# EasyEDA Pro project ALLModule_v1_0_2025-04-21.eprj, schematic MasterCtrlSchematic

## Sheets
1 MasterChip: Board Name: MasterCtrlBoard; Create Date: 2025-04-21; Page Name: MasterChip; Project Name: ALLModule_v1_0_2025-04-21; Schematic Name: MasterCtrlSchematic; Update Date: 2025-04-30; Company: 嘉立创EDA; Drawed: BumpZhi; Page Size: A4; Version: V1.0
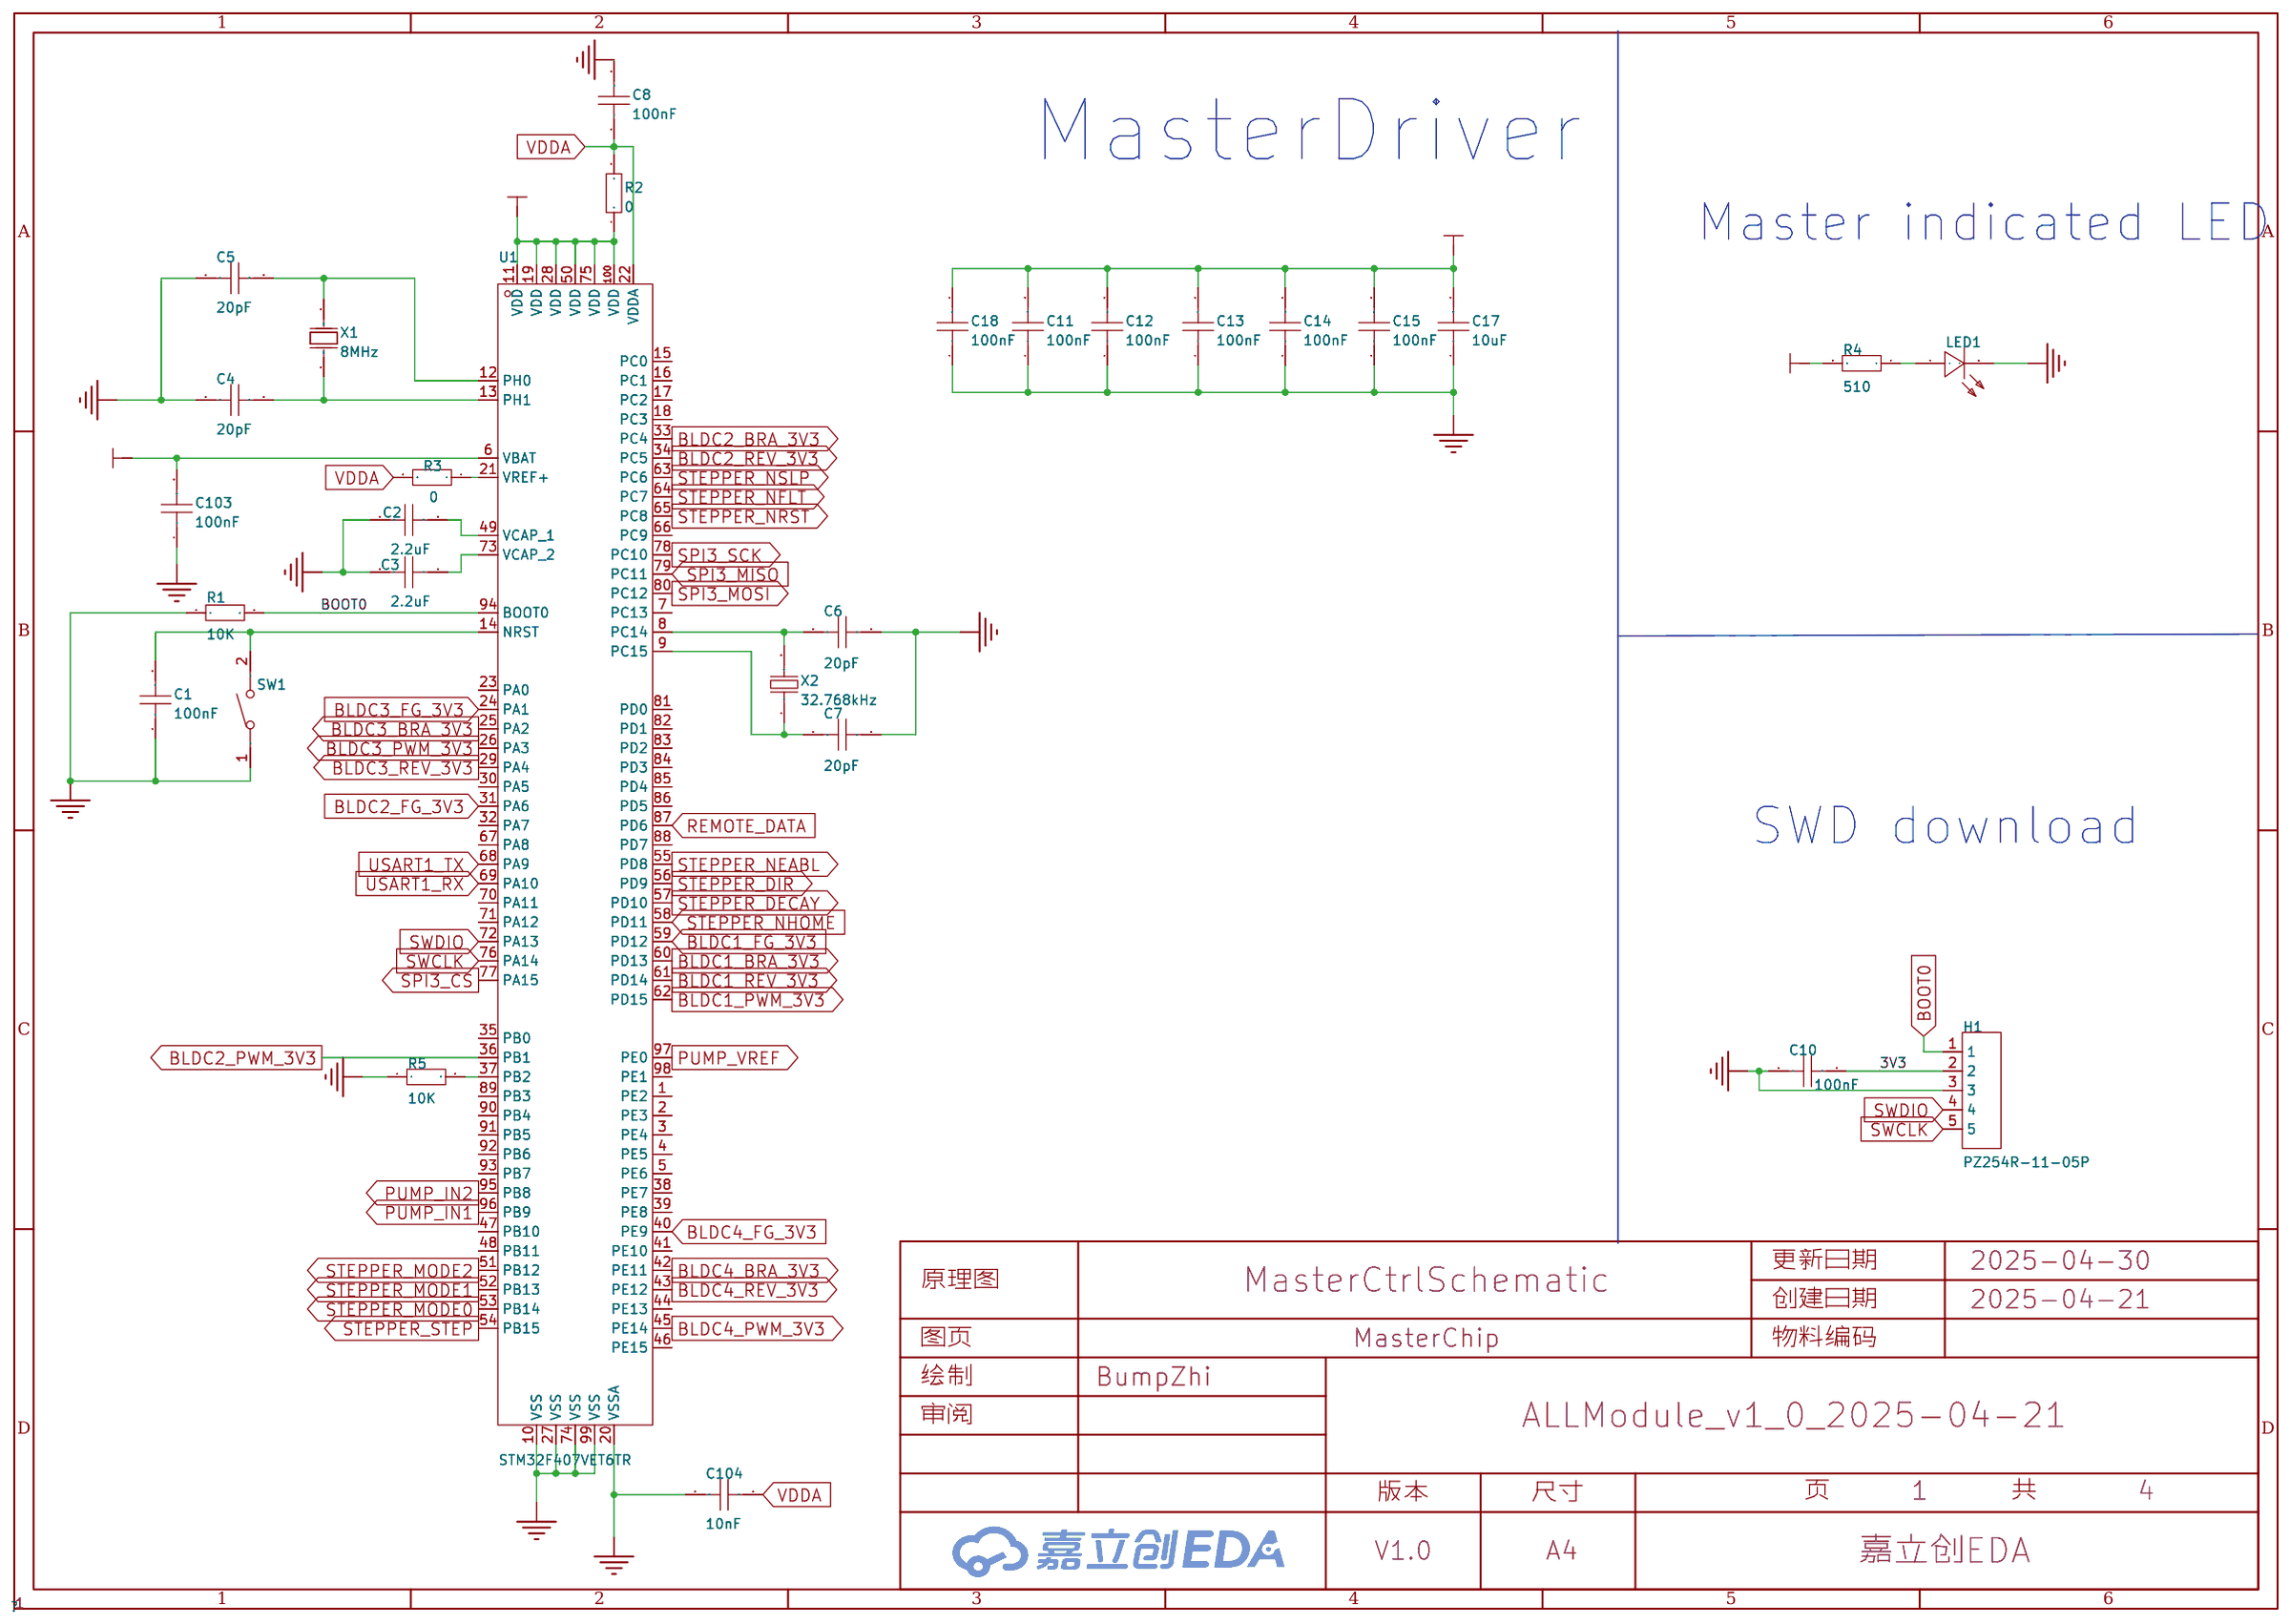
[diagram p0: MasterChip]
2 PowerCtrl: Create Date: 2025-04-22; Page Name: PowerCtrl; Update Date: 2025-05-10
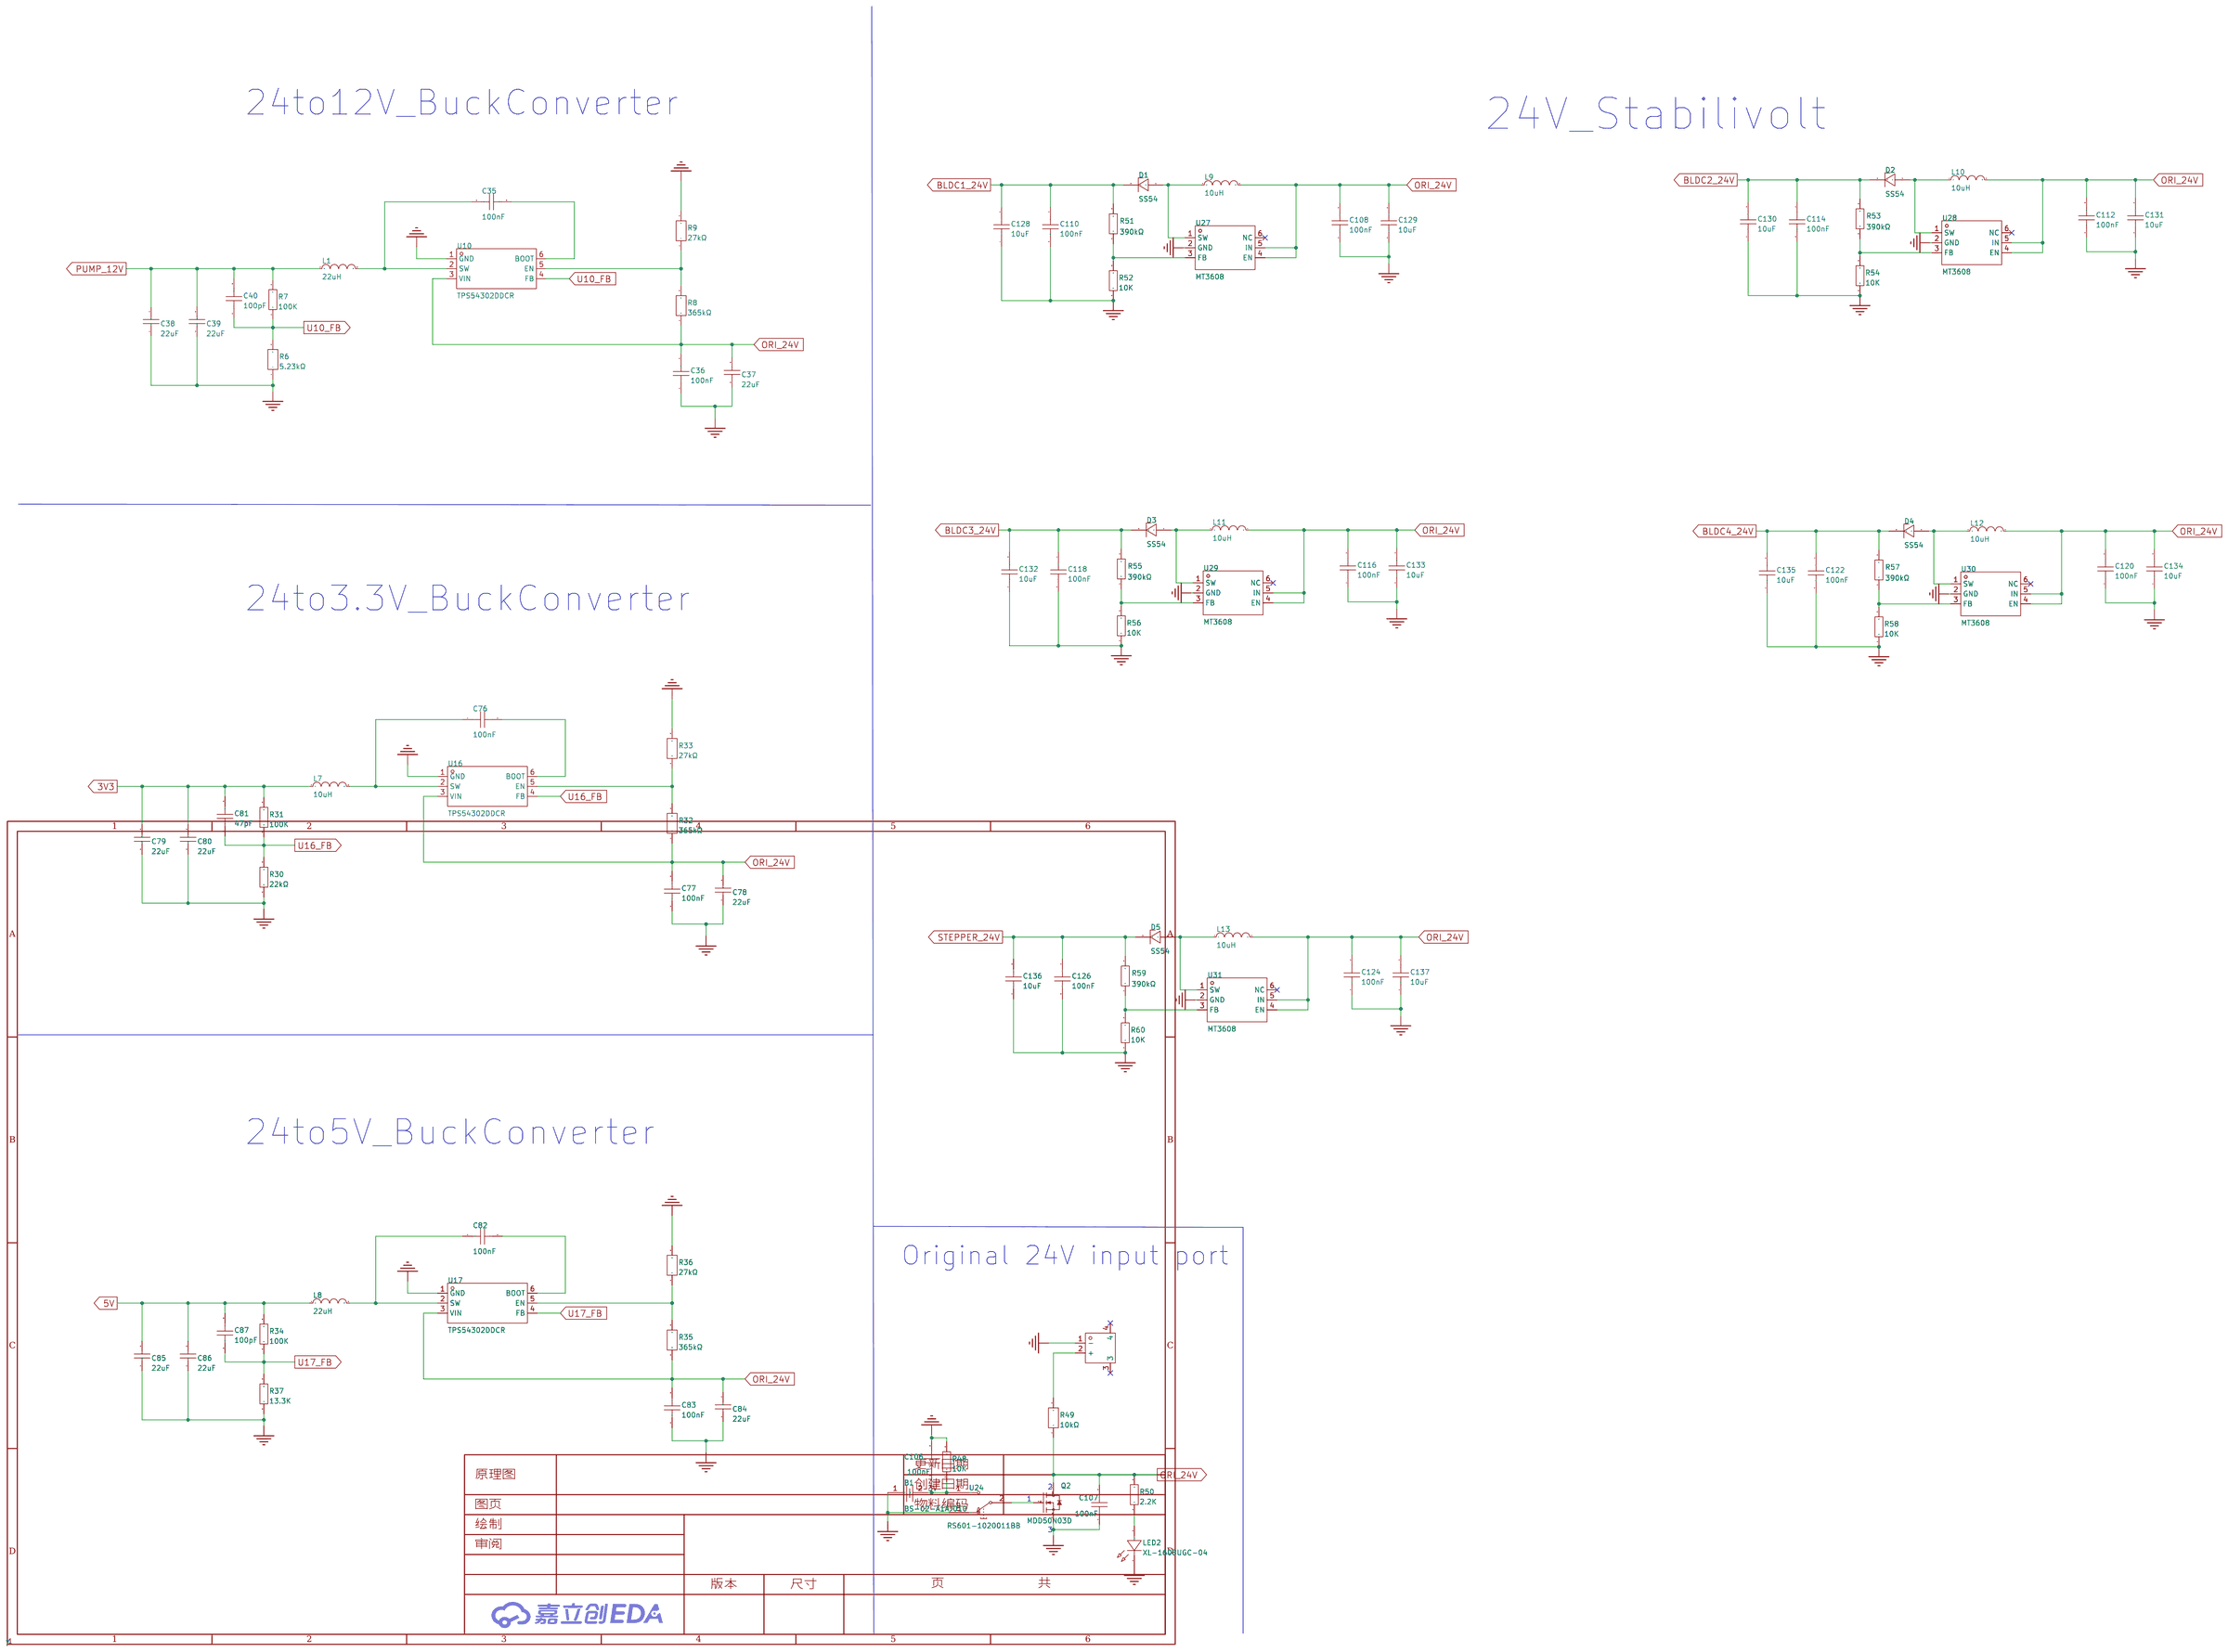
[diagram p1: PowerCtrl]
3 MotorCtrl: Create Date: 2025-04-23; Page Name: MotorCtrl; Update Date: 2025-04-28
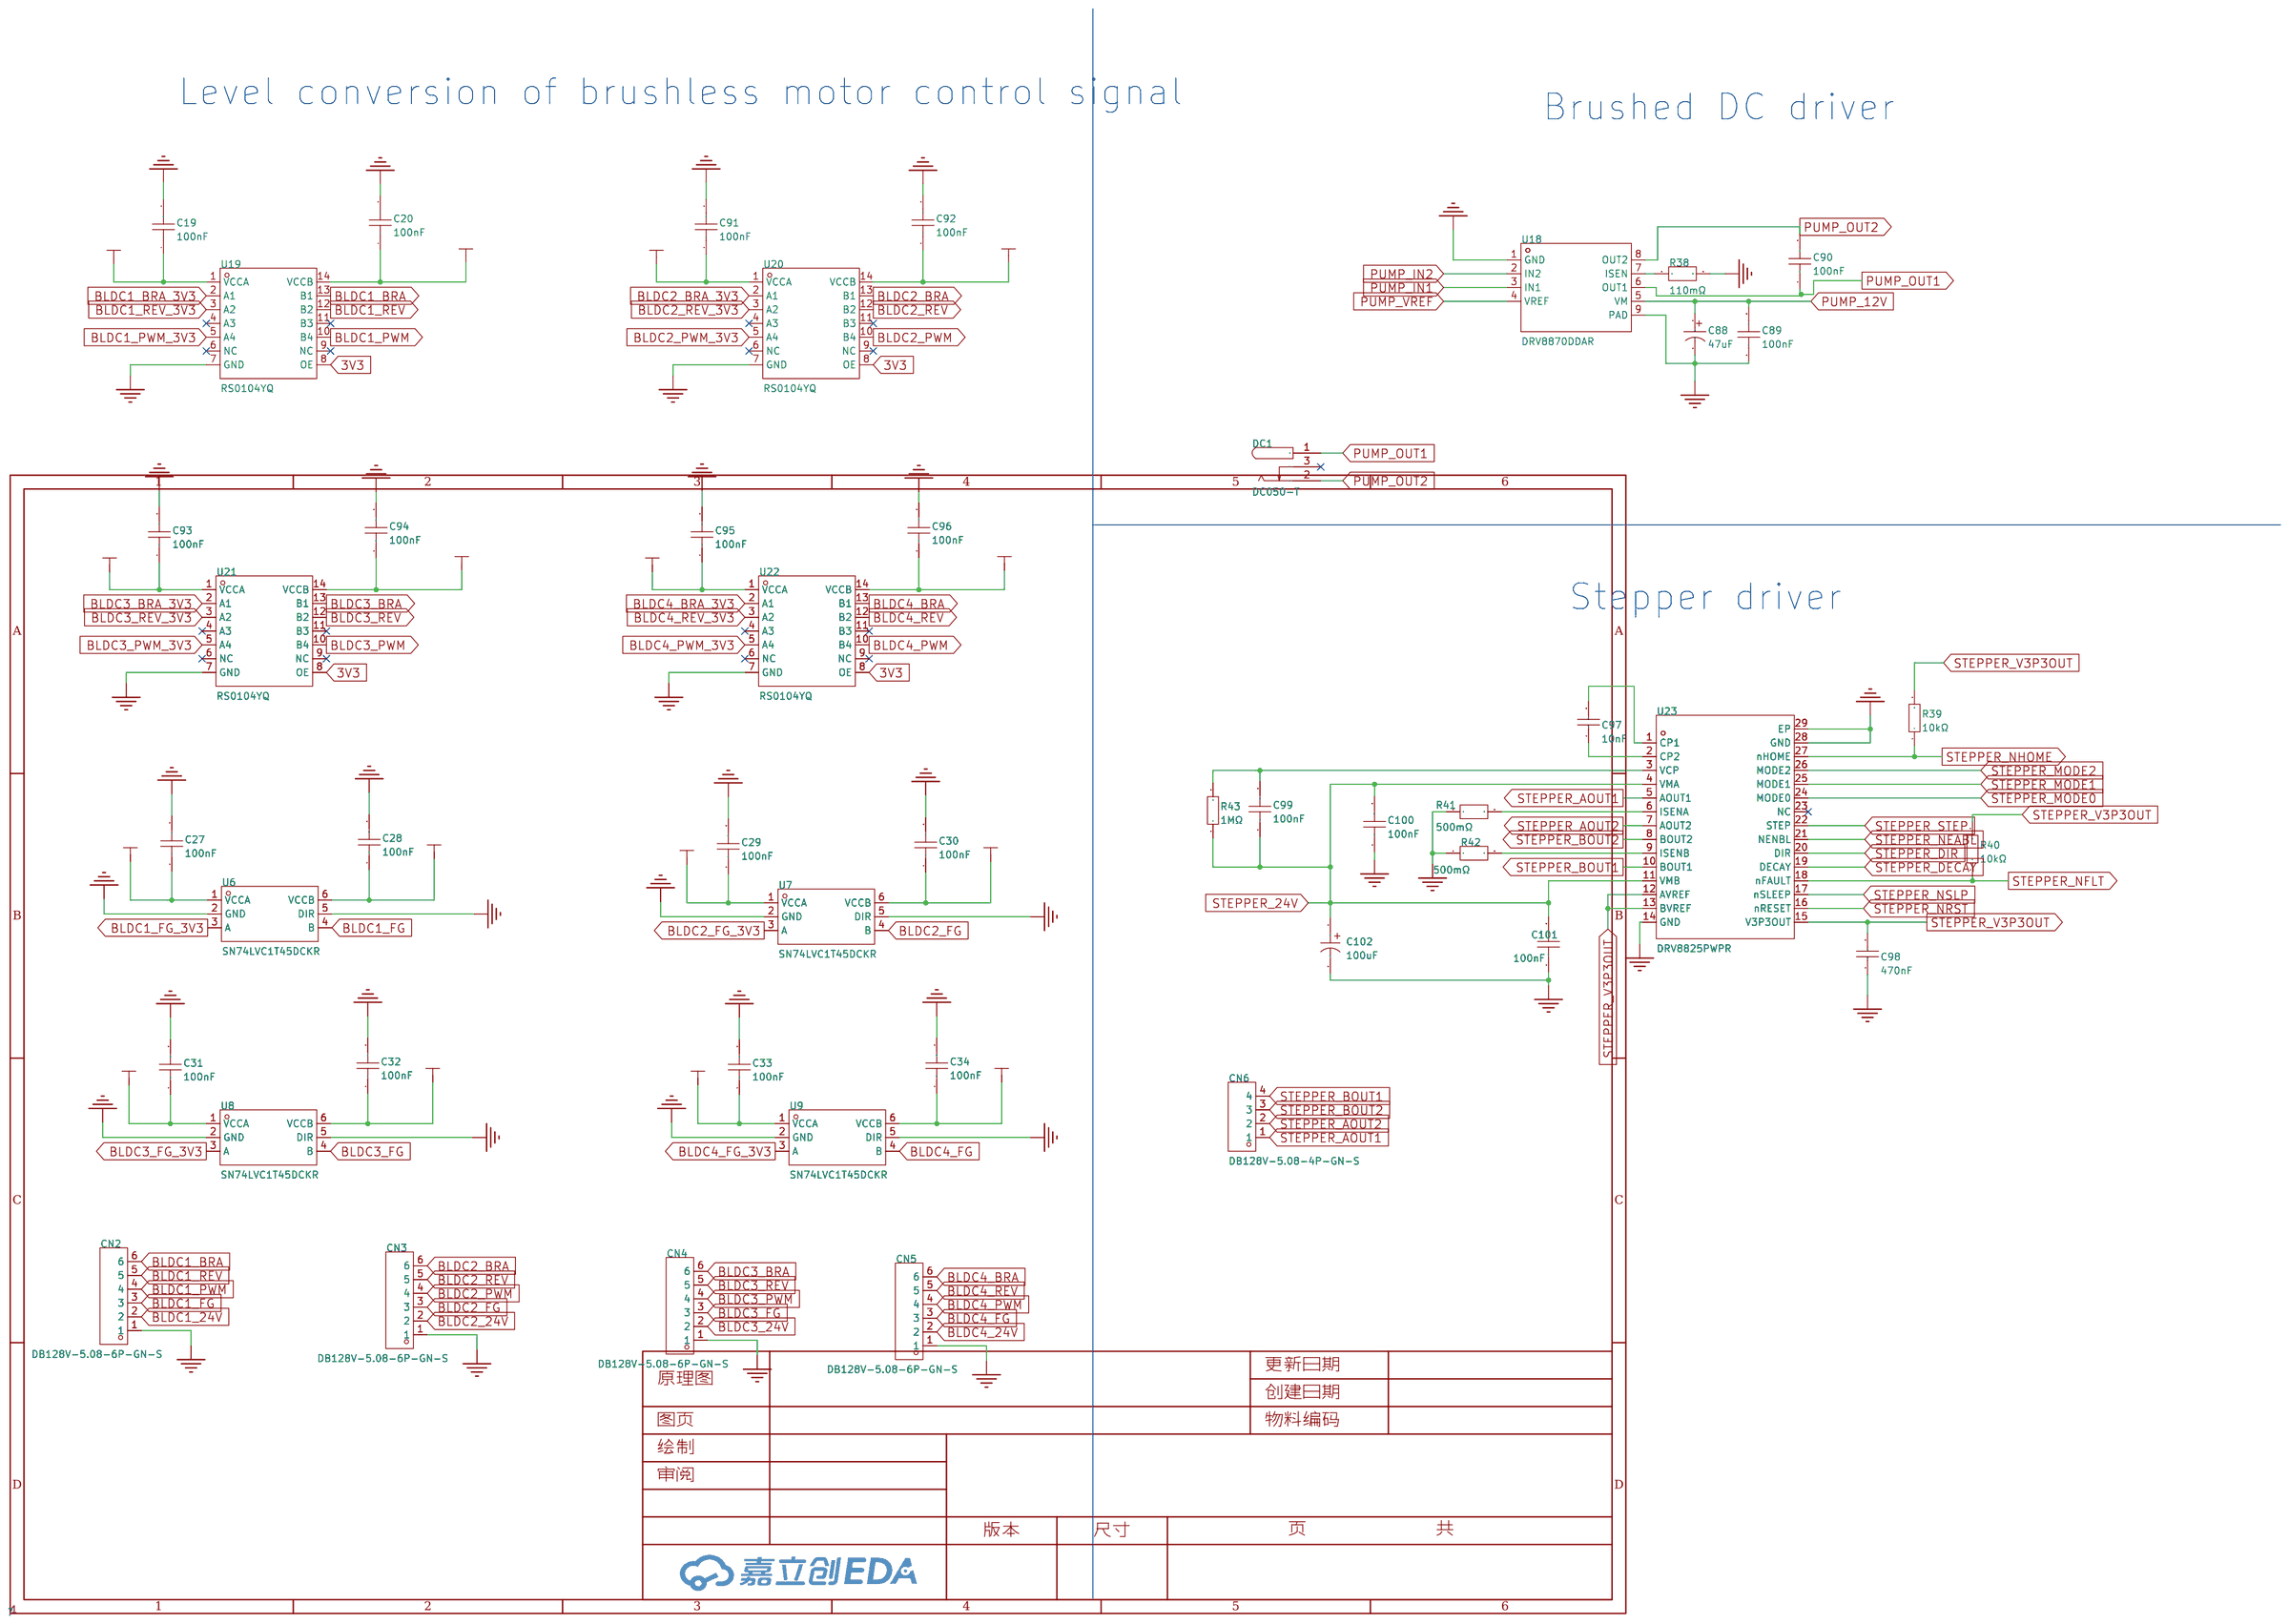
[diagram p2: MotorCtrl]
4 RemoteCtrl: Create Date: 2025-04-23; Page Name: RemoteCtrl
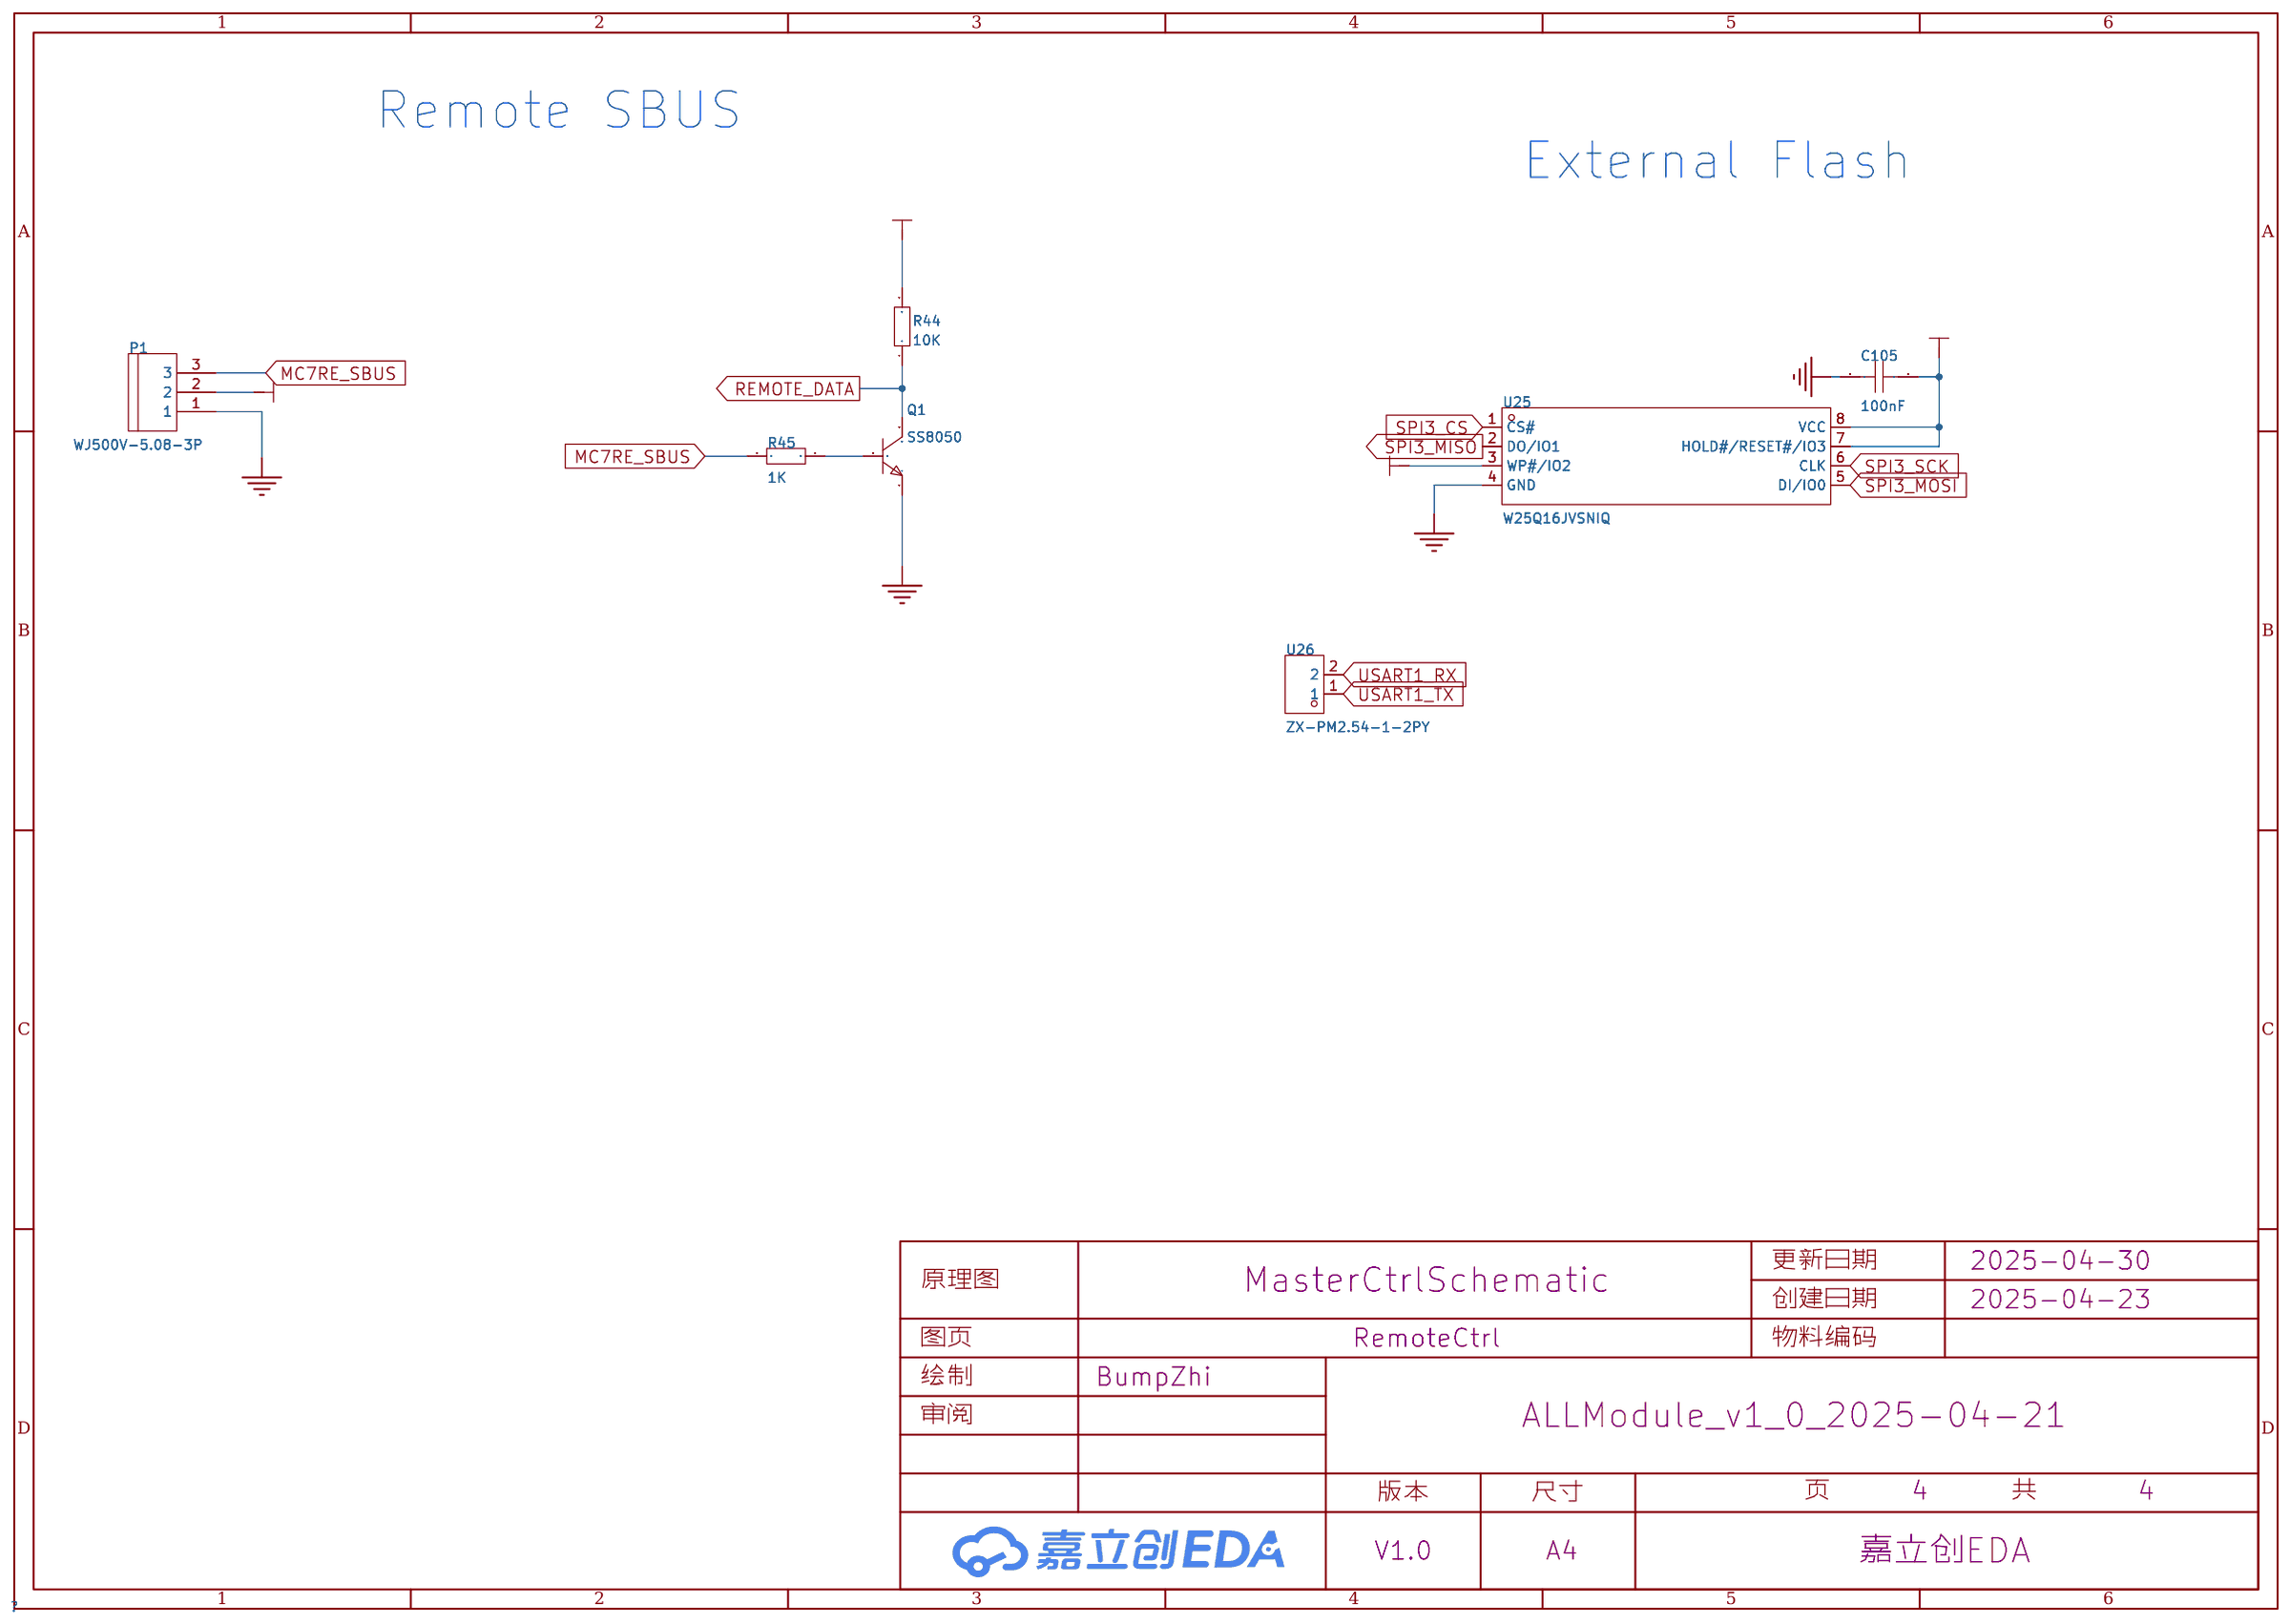
[diagram p3: RemoteCtrl]

## Parts
sheet MasterChip
C1  100nF  [C0603]
C2  2.2uF  [C0603]
C3  2.2uF  [C0603]
C4  20pF  [C0603]
C5  20pF  [C0603]
C6  20pF  [C0603]
C7  20pF  [C0603]
C8  100nF  [C0603]
C10  100nF  [C0603]
C11  100nF  [C0603]
C12  100nF  [C0603]
C13  100nF  [C0603]
C14  100nF  [C0603]
C15  100nF  [C0603]
C17  10uF  [C0603]
C18  100nF  [C0603]
C103  100nF  [C0603]
C104  10nF  [C0603]
H1  PZ254R-11-05P  [HDR-TH_5P-P2.54-H-M-W10.4]
LED1  SZYY0805R  [LED0805-R-RD]
R1  10K  [R0603]
R2  0  [R0603]
R3  0  [R0603]
R4  510  [R0603]
R5  10K  [R0603]
SW1  TS-1088-AR02016  [SW-SMD_L3.9-W3.0-P4.45]
U1  STM32F407VET6TR  [LQFP-100_L14.0-W14.0-P0.50-LS16.0-BL]
X1  8MHz  [CRYSTAL-SMD_L11.5-W4.8-LS12.7]
X2  32.768kHz  [FC-135R_L3.2-W1.5]
sheet MotorCtrl
C19  100nF  [C0603]
C20  100nF  [C0603]
C27  100nF  [C0603]
C28  100nF  [C0603]
C29  100nF  [C0603]
C30  100nF  [C0603]
C31  100nF  [C0603]
C32  100nF  [C0603]
C33  100nF  [C0603]
C34  100nF  [C0603]
C88  47uF  [CAP-TH_BD6.3-P2.50-D1.0-FD]
C89  100nF  [C0603]
C90  100nF  [C0603]
C91  100nF  [C0603]
C92  100nF  [C0603]
C93  100nF  [C0603]
C94  100nF  [C0603]
C95  100nF  [C0603]
C96  100nF  [C0603]
C97  10nF  [C0603]
C98  470nF  [C0603]
C99  100nF  [C0603]
C100  100nF  [C0603]
C101  100nF  [C0603]
C102  100uF  [CAP-SMD_BD8.1-L8.3-W8.3-LS9.3-FD]
CN2  DB128V-5.08-6P-GN-S  [CONN-TH_6P-P5.08_DIBO_DB128V-5.08]
CN3  DB128V-5.08-6P-GN-S  [CONN-TH_6P-P5.08_DIBO_DB128V-5.08]
CN4  DB128V-5.08-6P-GN-S  [CONN-TH_6P-P5.08_DIBO_DB128V-5.08]
CN5  DB128V-5.08-6P-GN-S  [CONN-TH_6P-P5.08_DIBO_DB128V-5.08]
CN6  DB128V-5.08-4P-GN-S  [CONN-TH_4P-P5.08_DIBO_DB128V-5.08]
DC1  DC050-T  [DC-IN_DC050-T]
R38  110mΩ  [R1206]
R39  10kΩ  [R0603]
R40  10kΩ  [R0603]
R41  500mΩ  [R0603]
R42  500mΩ  [R0603]
R43  1MΩ  [R0603]
U6  SN74LVC1T45DCKR  [SC-70-6_L2.2-W1.3-P0.65-LS2.2-BR]
U7  SN74LVC1T45DCKR  [SC-70-6_L2.2-W1.3-P0.65-LS2.2-BR]
U8  SN74LVC1T45DCKR  [SC-70-6_L2.2-W1.3-P0.65-LS2.2-BR]
U9  SN74LVC1T45DCKR  [SC-70-6_L2.2-W1.3-P0.65-LS2.2-BR]
U18  DRV8870DDAR  [HSOP-8_L5.0-W4.0-P1.27-LS6.2-BL-EP]
U19  RS0104YQ  [TSSOP-14_L5.0-W4.4-P0.65-LS6.4-BL]
U20  RS0104YQ  [TSSOP-14_L5.0-W4.4-P0.65-LS6.4-BL]
U21  RS0104YQ  [TSSOP-14_L5.0-W4.4-P0.65-LS6.4-BL]
U22  RS0104YQ  [TSSOP-14_L5.0-W4.4-P0.65-LS6.4-BL]
U23  DRV8825PWPR  [HTSSOP-28_L9.7-W4.4-P0.65-LS6.4-BL-EP]
sheet PowerCtrl
B1  BS-02-A1AJ010  [BAT-TH_BS-02-A1AJ010]
C35  100nF  [C0603]
C36  100nF  [C0603]
C37  22uF  [C1206]
C38  22uF  [C1206]
C39  22uF  [C1206]
C40  100pF  [C0603]
C76  100nF  [C0603]
C77  100nF  [C0603]
C78  22uF  [C1206]
C79  22uF  [C1206]
C80  22uF  [C1206]
C81  47pF  [C0603]
C82  100nF  [C0603]
C83  100nF  [C0603]
C84  22uF  [C1206]
C85  22uF  [C1206]
C86  22uF  [C1206]
C87  100pF  [C0603]
C106  100nF  [C0603]
C107  100nF  [C0603]
C108  100nF  [C0603]
C110  100nF  [C0603]
C112  100nF  [C0603]
C114  100nF  [C0603]
C116  100nF  [C0603]
C118  100nF  [C0603]
C120  100nF  [C0603]
C122  100nF  [C0603]
C124  100nF  [C0603]
C126  100nF  [C0603]
C128  10uF  [C1206]
C129  10uF  [C1206]
C130  10uF  [C1206]
C131  10uF  [C1206]
C132  10uF  [C1206]
C133  10uF  [C1206]
C134  10uF  [C1206]
C135  10uF  [C1206]
C136  10uF  [C1206]
C137  10uF  [C1206]
CN1  XT60PW-M  [CONN-TH_XT60PW-M]
D1  SS54  [SMA_L4.3-W2.6-LS5.0-FD]
D2  SS54  [SMA_L4.3-W2.6-LS5.0-FD]
D3  SS54  [SMA_L4.3-W2.6-LS5.0-FD]
D4  SS54  [SMA_L4.3-W2.6-LS5.0-FD]
D5  SS54  [SMA_L4.3-W2.6-LS5.0-FD]
L1  22uH  [IND-SMD_L7.0-W6.6_FXL0630]
L7  10uH  [IND-SMD_L7.3-W6.8]
L8  22uH  [IND-SMD_L7.3-W6.8]
L9  10uH  [IND-SMD_L7.3-W6.8]
L10  10uH  [IND-SMD_L7.3-W6.8]
L11  10uH  [IND-SMD_L7.3-W6.8]
L12  10uH  [IND-SMD_L7.3-W6.8]
L13  10uH  [IND-SMD_L7.3-W6.8]
LED2  XL-1608UGC-04  [LED0603-RD_GREEN]
Q2  MDD50N03D  [TO-252-2_L6.6-W6.1-P4.57-LS9.9-BR-CW]
R6  5.23kΩ  [R0805]
R7  100K  [R0603]
R8  365kΩ  [R1210]
R9  27kΩ  [R0603]
R30  22kΩ  [R0603]
R31  100K  [R0603]
R32  365kΩ  [R1210]
R33  27kΩ  [R0603]
R34  100K  [R0603]
R35  365kΩ  [R1210]
R36  27kΩ  [R0603]
R37  13.3K  [R0603]
R48  10K  [R0603]
R49  10kΩ  [R1206]
R50  2.2K  [R0603]
R51  390kΩ  [R0603]
R52  10K  [R0603]
R53  390kΩ  [R0603]
R54  10K  [R0603]
R55  390kΩ  [R0603]
R56  10K  [R0603]
R57  390kΩ  [R0603]
R58  10K  [R0603]
R59  390kΩ  [R0603]
R60  10K  [R0603]
U10  TPS54302DDCR  [SOT-23-6_L2.9-W1.6-P0.95-LS2.8-BL]
U16  TPS54302DDCR  [SOT-23-6_L2.9-W1.6-P0.95-LS2.8-BL]
U17  TPS54302DDCR  [SOT-23-6_L2.9-W1.6-P0.95-LS2.8-BL]
U24  RS601-1020011BB  [SW-TH_RS601-1020011BB]
U27  MT3608  [SOT-23-6_L2.9-W1.6-P0.95-LS2.8-BL]
U28  MT3608  [SOT-23-6_L2.9-W1.6-P0.95-LS2.8-BL]
U29  MT3608  [SOT-23-6_L2.9-W1.6-P0.95-LS2.8-BL]
U30  MT3608  [SOT-23-6_L2.9-W1.6-P0.95-LS2.8-BL]
U31  MT3608  [SOT-23-6_L2.9-W1.6-P0.95-LS2.8-BL]
sheet RemoteCtrl
C105  100nF  [C0603]
P1  WJ500V-5.08-3P  [CONN-TH_3P-P5.00_WJ500V-5.08-3P]
Q1  SS8050  [SOT-23-3_L2.9-W1.3-P1.90-LS2.4-BR]
R44  10K  [R0603]
R45  1K  [R0603]
U25  W25Q16JVSNIQ  [SOP-8_L4.9-W3.9-P1.27-LS6.0-BL]
U26  ZX-PM2.54-1-2PY  [HDR-TH_2P-P2.54-V-F]

## Library data of the parts
C1-C8 C10-C15 C17-C20 C27-C36 C76 C77 C82 C83 C91-C96 C103-C108 C110 C112 C114 C116 C118 C120 C122 C124 C126 = CAP_0603: Supplier Footprint: 0603
H1 = PZ254R-11-05P: LCSC Part Name: 1x5P 间距:2.54mm 方针 弯插; Supplier Part: C492413; Manufacturer: XFCN(兴飞); Supplier Footprint: 弯插,P=2.54mm; JLCPCB Part Class: 扩展库; Datasheet: https://atta.szlcsc.com/upload/public/pdf/source/20200309/C492413_82088D06BDD816AEC12FB986624DD327.pdf; Supplier: LCSC; Pin Structure: 1x5P; Pitch: 2.54mm; Circluar Pins/Square Pins: 方针; Mounting Type: 弯插; Number of Rows: 单排; Number of Pins: 5P; Length of Mating Pin: 6mm; Insulation Height: 2.5mm; Contact Material: 黄铜; Operating Temperature: -40℃~+105℃; Color: 黑色
LED1 = SZYY0805R: LCSC Part Name: 红灯; Supplier Part: C434431; Manufacturer: yongyu(永裕光电); Supplier Footprint: 0805; JLCPCB Part Class: 扩展库; Datasheet: https://atta.szlcsc.com/upload/public/pdf/source/20191204/C434431_431C171B758FE4C37FA40B1B295AA7AB.pdf; Supplier: LCSC; Emitted Color: 红色; Power Dissipation: 40mW; Forward Current: 10mA; Dominant Wavelength: 615nm~630nm; Peak Wavelength: 645nm; Lens Color: 无色透明透镜; Viewing Angle: 120°; Operating Temperature: -40℃~+85℃
R1-R5 R7 R31 R34 R44 R45 R48 R50 R52 R54 R56 R58 R60 = Res_0603: Supplier Footprint: 0603
SW1 = TS-1088-AR02016: LCSC Part Name: 4*3*2mm 立贴 轻触开关; Supplier Part: C720477; Manufacturer: XUNPU(讯普); Supplier Footprint: SMD; JLCPCB Part Class: 扩展库; Datasheet: https://atta.szlcsc.com/upload/public/pdf/source/20200810/C720475_60D09DD6C54279ADDB2DC25100F1CC11.pdf; Supplier: LCSC; Circuit: 单刀单掷; Actuator Style: 圆形按钮; Operating Force: 160gf; Mounting Style: 立贴; Switch Length: 4mm; Switch Width: 3mm; Switch Height: 2mm; Strike Gundam: 不带; Contact Current: 50mA; Voltage Rating (DC): 12V; Insulation Resistance: 100MΩ; Actuator/Cap Color: 黑色; Pin Style: SMD接片; Mechanical Life: 10万次; Operating Temperature: -30℃~+80℃
U1 = STM32F407VET6TR: LCSC Part Name: 带DSP和FPU的高性能基础系列ARM Cortex-M4 MCU，具有512 KB Flash、168 MHz CPU、ART加速器、以太网和FSMC; Supplier Part: C5269943; Manufacturer: ST(意法半导体); Supplier Footprint: LQFP-100(14x14); JLCPCB Part Class: 扩展库; Datasheet: https://atta.szlcsc.com/upload/public/pdf/source/20201130/C919362_39400D478C258148B3DF984CE4A4041A.pdf; Supplier: LCSC; CPU Core: ARM-M4; CPU Maximum Speed: 168MHz; Number of I/O: 82; ADC (Bit): 12bit; DAC (Bit): 12bit; Low Voltage Detection Threshold: 1.8V~3.6V
X1 = X49SM8MSD2SC: LCSC Part Name: 8MHz ±20ppm 20pF; Supplier Part: C12674; Manufacturer: YXC(扬兴晶振); Supplier Footprint: HC-49S-SMD; JLCPCB Part Class: 基础库; Datasheet: https://atta.szlcsc.com/upload/public/pdf/source/20240329/3EBF42EBCAB50CA65B6FA9D7CFA1955A.pdf; Supplier: LCSC; Crystal Type: 贴片晶振; Normal temperature Frequency Tolerance: ±20ppm; External load capacitor: 20pF; Frequency Stability(Full temperature range): ±30ppm; Operating Temperature: -20℃~+70℃
X2 = Q13FC13500004_C32346: LCSC Part Name: 32.768kHz ±20ppm 12.5pF; Supplier Part: C32346; Manufacturer: EPSON(爱普生); Manufacturer Part: Q13FC13500004; Supplier Footprint: SMD3215-2P; JLCPCB Part Class: 基础库; Datasheet: https://atta.szlcsc.com/upload/public/pdf/source/20240418/0E0FF5F0356BA3753F616001439D1416.pdf; Supplier: LCSC; Crystal Type: 贴片晶振; Normal temperature Frequency Tolerance: ±20ppm; Load Capacitor: 12.5pF; Equivalent Series Resistance (ESR): 70kΩ; Operating Temperature: -40℃~+85℃
C88 = KM476M050E11RR0VH2FP0: 容值:47uF;精度:±20%;额定电压:50V;; LCSC Part Name: 47uF ±20% 50V; Supplier Part: C45101; Manufacturer: CX(承兴); Supplier Footprint: 插件,D6.3xL11mm; JLCPCB Part Class: 扩展库; Datasheet: https://atta.szlcsc.com/upload/public/pdf/source/20230413/4F329AA96A66424FD3FF29340EA7427F.pdf; Supplier: LCSC; Tolerance: ±20%; Rated Voltage: 50V; Lead Spacing: 2.5mm; φD: 6.3mm; L: 11mm; Lifetime @ Temp: 1000hrs@105℃
C89 C90 C99-C101 = CGA0603X7R104K500JT: 容值:100nF;精度:±10%;额定电压:50V;温度系数:X7R;; LCSC Part Name: 100nF ±10% 50V; Supplier Part: C6119867; Manufacturer: HRE(芯声); Supplier Footprint: 0603; JLCPCB Part Class: 扩展库; Datasheet: https://atta.szlcsc.com/upload/public/pdf/source/20250103/C44077DA9E7B3EFAE02F22B6D3D1CBC9.pdf; Supplier: LCSC; Tolerance: ±10%; Voltage Rating: 50V; Temperature Coefficient: X7R
C97 = CL10B103KB8NNNC: 容值:10nF;精度:±10%;额定电压:50V;材质(温度系数):X7R;; LCSC Part Name: 10nF ±10% 50V; Supplier Part: C1589; Manufacturer: SAMSUNG(三星); Supplier Footprint: 0603; JLCPCB Part Class: 扩展库; Datasheet: https://atta.szlcsc.com/upload/public/pdf/source/20160218/1457707763339.pdf; Supplier: LCSC; Tolerance: ±10%; Voltage Rated: 50V; Temperature Coefficient: X7R
C98 = CL10B474KA8NNNC: 容值:470nF;精度:±10%;额定电压:25V;材质(温度系数):X7R;; LCSC Part Name: 470nF ±10% 25V; Supplier Part: C1623; Manufacturer: SAMSUNG(三星); Supplier Footprint: 0603; JLCPCB Part Class: 基础库; Datasheet: https://atta.szlcsc.com/upload/public/pdf/source/20160218/1457707763339.pdf; Supplier: LCSC; Tolerance: ±10%; Voltage Rated: 25V; Temperature Coefficient: X7R
C102 = GVE1H107M0810CNVC: 容值:100uF;精度:±20%;额定电压:50V;纹波电流:300mA@100kHz;等效串联电阻:600mΩ@100kHz;; LCSC Part Name: 100uF ±20% 50V; Supplier Part: C2983307; Manufacturer: HRK(鸿瑞凯电子); Supplier Footprint: SMD,D8xL10.5mm; JLCPCB Part Class: 扩展库; Datasheet: https://atta.szlcsc.com/upload/public/pdf/source/20220321/B5A059027F69866A3EEEBC781A889613.pdf; Supplier: LCSC; Tolerance: ±20%; Rated Voltage: 50V; Ripple Current: 300mA@100kHz; Equivalent Series Resistance(ESR): 600mΩ@100kHz; φD: 8mm; L: 10.5mm; Lifetime @ Temp: 2000hrs@105℃; Operating Temperature: -55℃~+105℃
CN2-CN5 = DB128V-5.08-6P-GN-S: LCSC Part Name: 5.08mm 1x6P 排数:1 每排P数:6 直插; Supplier Part: C2915642; Manufacturer: DORABO(地博电气); Supplier Footprint: 插件,P=5.08mm; JLCPCB Part Class: 扩展库; Datasheet: https://atta.szlcsc.com/upload/public/pdf/source/20230106/CC449C10514519CDCE20F1C37DBF2DAC.pdf; Supplier: LCSC; Structure: 1x6P; Pitch: 5.08mm; Color: 绿色; Mounting Style: 直插; Current Rating (Max): 20A; Voltage Rating (Max): 300V; Number of Pins: 6P; Number of Rows: 1; Wire Gauge - AWG: 12~30; Wire Gauge - mm2: 2.5; Number of PINs Per Row: 6; Operating Temperature Range: -40℃~+105℃
CN6 = DB128V-5.08-4P-GN-S: LCSC Part Name: 5.08mm 1x4P 排数:1 每排P数:4 直插; Supplier Part: C2915641; Manufacturer: DORABO(地博电气); Supplier Footprint: 插件,P=5.08mm; JLCPCB Part Class: 扩展库; Datasheet: https://atta.szlcsc.com/upload/public/pdf/source/20230106/CC449C10514519CDCE20F1C37DBF2DAC.pdf; Supplier: LCSC; Structure: 1x4P; Pitch: 5.08mm; Color: 绿色; Mounting Style: 直插; Current Rating (Max): 20A; Voltage Rating (Max): 300V; Number of Pins: 4P; Number of Rows: 1; Wire Gauge - AWG: 12~30; Wire Gauge - mm2: 2.5; Number of PINs Per Row: 4; Operating Temperature Range: -40℃~+105℃
DC1 = DC050-T: LCSC Part Name: DC电源插座 内径:2mm 外径:6.4mm; Supplier Part: C431534; Manufacturer: SHOU HAN(首韩); Supplier Footprint: SMD; JLCPCB Part Class: 扩展库; Datasheet: https://atta.szlcsc.com/upload/public/pdf/source/20241230/47AFDAED5CA2AEF49E0D72E48671546A.pdf; Supplier: LCSC; Connector Type: DC电源插座; Mounting Style: 卧贴; Inside Contact Diameter: 2mm; Outside Contact Diameter: 6.4mm; Current Rating (Max): 2A; Voltage Rating (Max): 30V; Operating Temperature Range: -25℃~+70℃
R38 = FRL1206FR110TS: 电阻类型:厚膜电阻;阻值:110mΩ;精度:±1%;功率:250mW;最大工作电压:500V;温度系数:±600ppm/℃;; LCSC Part Name: 110mΩ ±1% 250mW 厚膜电阻; Supplier Part: C2934288; Manufacturer: FOJAN(富捷); Supplier Footprint: 1206; JLCPCB Part Class: 扩展库; Datasheet: https://atta.szlcsc.com/upload/public/pdf/source/20211221/925EC7D7225764EE0046F22065062C87.pdf; Supplier: LCSC; Type: 厚膜电阻; Tolerance: ±1%; Power(Watts): 250mW; Overload Voltage (Max): 500V; Temperature Coefficient: ±600ppm/℃; Operating Temperature Range: -55℃~+155℃
R39 R40 = RC0603FR-0710KL: 电阻类型:厚膜电阻;阻值:10kΩ;精度:±1%;功率:100mW;最大工作电压:75V;温度系数:±100ppm/℃;; LCSC Part Name: 厚膜电阻 10kΩ ±1% 100mW; Supplier Part: C98220; Manufacturer: YAGEO(国巨); Supplier Footprint: 0603; JLCPCB Part Class: 扩展库; Datasheet: https://atta.szlcsc.com/upload/public/pdf/source/20180927/C295883_E8D83085EA81BD7DE0B2B681138C15EE.pdf; Supplier: LCSC; Type: 厚膜电阻; Tolerance: ±1%; Power(Watts): 100mW; Overload Voltage (Max): 75V; Temperature Coefficient: ±100ppm/℃; Operating Temperature Range: -55℃~+155℃
R41 R42 = FRL0603JR500TS: 电阻类型:厚膜电阻;阻值:500mΩ;精度:±5%;功率:100mW;最大工作电压:100V;温度系数:±300ppm/℃;; LCSC Part Name: 500mΩ ±5% 100mW 厚膜电阻; Supplier Part: C2930046; Manufacturer: FOJAN(富捷); Supplier Footprint: 0603; JLCPCB Part Class: 扩展库; Datasheet: https://atta.szlcsc.com/upload/public/pdf/source/20211221/925EC7D7225764EE0046F22065062C87.pdf; Supplier: LCSC; Type: 厚膜电阻; Tolerance: ±5%; Power(Watts): 100mW; Overload Voltage (Max): 100V; Temperature Coefficient: ±300ppm/℃; Operating Temperature Range: -55℃~+155℃
R43 = 0603WAF1004T5E: 电阻类型:厚膜电阻;阻值:1MΩ;精度:±1%;功率:100mW;最大工作电压:75V;温度系数:±100ppm/℃;; LCSC Part Name: 1MΩ ±1% 100mW 厚膜电阻; Supplier Part: C22935; Manufacturer: UNI-ROYAL(厚声); Supplier Footprint: 0603; JLCPCB Part Class: Basic Part; Datasheet: https://atta.szlcsc.com/upload/public/pdf/source/20200306/C422600_1E6D84923E4A46A82E41ADD87F860B5C.pdf; Supplier: LCSC; Type: 厚膜电阻; Tolerance: ±1%; Power(Watts): 100mW; Overload Voltage (Max): 75V; Temperature Coefficient: ±100ppm/℃; Operating Temperature Range: -55℃~+155℃
U6-U9 = SN74LVC1T45DCKR: Supplier Part: C9382; Manufacturer: TI(德州仪器); Supplier Footprint: SC-70-6; JLCPCB Part Class: 扩展库; Datasheet: https://www.ti.com/cn/lit/gpn/sn74lvc1t45; Supplier: LCSC; Channel Type: 双向; Data Rate: 420Mbps; Supply Voltage (VCCA): 1.65V~5.5V; Supply Voltage (VCCB): 1.65V~5.5V; Number of Circuits: 1; Channels per Circuit: 1; Output Type: 非反相；三态; Operating Temperature: -40℃~+85℃
U18 = DRV8870DDAR: DRV8870 具有电流调节功能的 50V、3.6A、H 桥电机驱动器; Supplier Part: C86590; Manufacturer: TI(德州仪器); Supplier Footprint: HSOP-8-EP; JLCPCB Part Class: 扩展库; Datasheet: https://www.ti.com/cn/lit/gpn/drv8870; Supplier: LCSC
U19-U22 = RS0104YQ: Supplier Part: C2762288; Manufacturer: RUNIC(润石); Supplier Footprint: TSSOP-14; JLCPCB Part Class: 扩展库; Datasheet: https://atta.szlcsc.com/upload/public/pdf/source/20210326/C2762288_047AD9A0F3596B818F72E78761722A97.pdf; Supplier: LCSC; Channel Type: 双向; Data Rate: 24Mbps; Supply Voltage (VCCA): 1.65V~5.5V; Supply Voltage (VCCB): 2.3V~5.5V; Number of Circuits: 1; Channels per Circuit: 4; Output Type: 推挽式；开路漏极; Operating Temperature: -40℃~+85℃
U23 = DRV8825PWPR: DRV8825 具有电流调节功能和 1/32 微步进的 45V、2.5A 双极步进电机驱动器; LCSC Part Name: 2.5A 45V电机驱动芯片; Supplier Part: C81582; Manufacturer: TI(德州仪器); Supplier Footprint: HTSSOP-28-EP; JLCPCB Part Class: 扩展库; Datasheet: https://www.ti.com/cn/lit/gpn/drv8825; Supplier: LCSC
B1 = BS-02-A1AJ010: LCSC Part Name: 电池底座 适用电池:CR2032; Supplier Part: C5239862; Manufacturer: MYOUNG(美阳); Supplier Footprint: 插件; JLCPCB Part Class: 扩展库; Datasheet: https://atta.szlcsc.com/upload/public/pdf/source/20221102/8F00F2B23A2A3C447A59C327BBA6C743.pdf; Supplier: LCSC; Connector Type: 电池底座; Battery Type: CR2032; Contact Material: 磷青铜; Contact Plating: 镍; Operating Temperature Range: -25℃~+85℃
C37-C39 C78-C80 C84-C86 = CL31A226KAHNNNE: 容值:22uF;精度:±10%;额定电压:25V;材质(温度系数):X5R;; LCSC Part Name: 22uF ±10% 25V; Supplier Part: C12891; Manufacturer: SAMSUNG(三星); Supplier Footprint: 1206; JLCPCB Part Class: 基础库; Datasheet: https://atta.szlcsc.com/upload/public/pdf/source/20160218/1457707763339.pdf; Supplier: LCSC; Tolerance: ±10%; Voltage Rated: 25V; Temperature Coefficient: X5R
C40 C81 C87 = CC0603JRNPO9BN101: 容值:100pF;精度:±5%;额定电压:50V;材质(温度系数):NP0;; LCSC Part Name: 100pF ±5% 50V; Supplier Part: C14665; Manufacturer: YAGEO(国巨); Supplier Footprint: 0603; JLCPCB Part Class: 扩展库; Datasheet: https://atta.szlcsc.com/upload/public/pdf/source/20181008/C309499_21CC21451B82C39E3D92150FD6B30293.pdf; Supplier: LCSC; Tolerance: ±5%; Voltage Rated: 50V; Temperature Coefficient: NP0
C128-C137 = HGC1206R5106K500NSPJ: LCSC Part Name: 10uF ±10% 50V; Supplier Part: C7432781; Manufacturer: Chinocera(华瓷); Supplier Footprint: 1206; JLCPCB Part Class: 扩展库; Datasheet: https://atta.szlcsc.com/upload/public/pdf/source/20240320/FAC3FEC40A78BC5CCCE96C232A94D860.pdf; Supplier: LCSC; Tolerance: ±10%; Voltage Rating: 50V; Temperature Coefficient: X5R
CN1 = XT60PW-M: LCSC Part Name: AMASS(艾迈斯)航模插头xt60连接器150公母对接pw锂电池公头 板插卧式XT60PW-M; Supplier Part: C98732; Manufacturer: AMASS(艾迈斯); JLCPCB Part Class: 扩展库; Datasheet: https://atta.szlcsc.com/upload/public/pdf/source/20240118/44A3DCFF53BE25DC65378AFFB21277A4.pdf; Supplier: LCSC; Brand: 艾迈斯; Type: 卧式插头; Colour: 黄色; InterfaceType: 公头
D1-D5 = SS54_C7420369: 二极管配置:独立式;正向压降(Vf):550mV@5.0A;直流反向耐压(Vr):40V;整流电流:5A;; LCSC Part Name: 电压:40V 电流:5A; Supplier Part: C7420369; Manufacturer: 宏迦橙; Supplier Footprint: SMA(DO-214AC); JLCPCB Part Class: 扩展库; Datasheet: https://atta.szlcsc.com/upload/public/pdf/source/20230828/254C3882F8647358AD9F60DD73611B5E.pdf; Supplier: LCSC; Diode Configuration: 独立式; Forward Voltage (Vf@If): 550mV@5.0A; Reverse Voltage (Vr): 40V; Rectified Current: 5A; Reverse Leakage Current (Ir): 50uA@40V
L1 = FXL0630-220-M: 电感值:22uH;精度:±20%;额定电流:2.5A;饱和电流(Isat):3A;类型:一体成型电感;; LCSC Part Name: 22uH ±20% 3A; Supplier Part: C177244; Manufacturer: cjiang(长江微电); Supplier Footprint: SMD,6.6x7mm; JLCPCB Part Class: 扩展库; Datasheet: https://atta.szlcsc.com/upload/public/pdf/source/20240426/3189EA8206330E2108542F9E34E540E7.pdf; Supplier: LCSC; Tolerance: ±20%; Rated Current: 2.5A; Saturation Current (Isat): 3A; DC Resistance (DCR): 200mΩ; Type: 一体成型电感
L7-L13 = FXL0630-100-M: 电感值:10uH;精度:±20%;额定电流:4.5A;饱和电流(Isat):5.5A;类型:一体成型电感;; LCSC Part Name: 10uH ±20% 5.5A; Supplier Part: C167223; Manufacturer: cjiang(长江微电); Supplier Footprint: SMD,6.6x7mm; JLCPCB Part Class: 扩展库; Datasheet: https://atta.szlcsc.com/upload/public/pdf/source/20240426/3189EA8206330E2108542F9E34E540E7.pdf; Supplier: LCSC; Tolerance: ±20%; Rated Current: 4.5A; Saturation Current (Isat): 5.5A; DC Resistance (DCR): 68mΩ; Type: 一体成型电感
LED2 = XL-1608UGC-04: Supplier Part: C965804; Manufacturer: XINGLIGHT(成兴光); Supplier Footprint: 0603; JLCPCB Part Class: 扩展库; Datasheet: https://atta.szlcsc.com/upload/public/pdf/source/20221102/520D6E465E5CFD1609C8A4DBC80D4018.pdf; Supplier: LCSC; Emitted Color: 翠绿色; Power Dissipation: 80mW; Forward Current: 25mA; Dominant Wavelength: 516nm~525nm; Peak Wavelength: 534nm; Diode Configuration: 独立二极管; Lens Color: 无色透明透镜; Viewing Angle: 120°; Mounting Sytle: 正贴; Operating Temperature: -30℃~+85℃
Q2 = MDD50N03D: LCSC Part Name: 1个N沟道 耐压:30V 电流:50A; Supplier Part: C5357578; Manufacturer: MDD(辰达半导体); Supplier Footprint: TO-252; JLCPCB Part Class: 扩展库; Datasheet: https://atta.szlcsc.com/upload/public/pdf/source/20241127/5772905FB43A0AFA5EE0DDECA5069698.pdf; Supplier: LCSC; Type: 1个N沟道; Drain Source Voltage (Vdss): 30V; Continuous Drain Current (Id): 50A; Drain Source On Resistance (RDS(on)@Vgs,Id): 9mΩ@10V; Power Dissipation (Pd): 28W; Gate Threshold Voltage (Vgs(th)@Id): 1V@250uA; Total Gate Charge (Qg@Vgs): 23.6nC@10V; Input Capacitance (Ciss@Vds): 1.015nF@15V; Reverse Transfer Capacitance (Crss@Vds): 164pF; Operating Temperature: -50℃~+150℃
R6 = FRC0805F5231TS: 电阻类型:厚膜电阻;阻值:5.23kΩ;精度:±1%;功率:125mW;工作电压:150V;温度系数:±100ppm/℃;; LCSC Part Name: 5.23kΩ ±1% 125mW 厚膜电阻; Supplier Part: C2933464; Manufacturer: FOJAN(富捷); Supplier Footprint: 0805; JLCPCB Part Class: 扩展库; Datasheet: https://atta.szlcsc.com/upload/public/pdf/source/20211221/925EC7D7225764EE0046F22065062C87.pdf; Supplier: LCSC; Type: 厚膜电阻; Tolerance: ±1%; Power(Watts): 125mW; Voltage-Supply(Max): 150V; Temperature Coefficient: ±100ppm/℃; Operating Temperature: -55℃~+155℃
R8 R32 R35 = AC1210FR-07365KL: 电阻类型:厚膜电阻;阻值:365kΩ;精度:±1%;功率:500mW;最大工作电压:200V;温度系数:±100ppm/℃;; LCSC Part Name: 厚膜电阻 365kΩ ±1% 500mW; Supplier Part: C230209; Manufacturer: YAGEO(国巨); Supplier Footprint: 1210; JLCPCB Part Class: 扩展库; Datasheet: https://atta.szlcsc.com/upload/public/pdf/source/20191108/C230504_7FB43CAE7E86B3B2980C2491161B254C.pdf; Supplier: LCSC; Type: 厚膜电阻; Tolerance: ±1%; Power(Watts): 500mW; Overload Voltage (Max): 200V; Temperature Coefficient: ±100ppm/℃; Operating Temperature Range: -55℃~+155℃
R9 R33 R36 = FRC0603F2702TS: 电阻类型:厚膜电阻;阻值:27kΩ;精度:±1%;功率:100mW;工作电压:75V;温度系数:±100ppm/℃;; LCSC Part Name: 27kΩ ±1% 100mW 厚膜电阻; Supplier Part: C2930084; Manufacturer: FOJAN(富捷); Supplier Footprint: 0603; JLCPCB Part Class: 扩展库; Datasheet: https://atta.szlcsc.com/upload/public/pdf/source/20211221/925EC7D7225764EE0046F22065062C87.pdf; Supplier: LCSC; Type: 厚膜电阻; Tolerance: ±1%; Power(Watts): 100mW; Voltage-Supply(Max): 75V; Temperature Coefficient: ±100ppm/℃; Operating Temperature: -55℃~+155℃
R30 R37 = 0603WAF2202T5E: LCSC Part Name: 22kΩ ±1% 100mW 厚膜电阻; Supplier Part: C31850; Manufacturer: UNI-ROYAL(厚声); Supplier Footprint: 0603; JLCPCB Part Class: 基础库; Datasheet: https://atta.szlcsc.com/upload/public/pdf/source/20200306/C422600_1E6D84923E4A46A82E41ADD87F860B5C.pdf; Supplier: LCSC; Type: 厚膜电阻; Tolerance: ±1%; Power(Watts): 100mW; Overload Voltage (Max): 75V; Temperature Coefficient: ±100ppm/℃; Operating Temperature Range: -55℃~+155℃
R49 = FRC1206J103 TS: LCSC Part Name: 10kΩ ±5% 250mW 厚膜电阻; Supplier Part: C2907423; Manufacturer: FOJAN(富捷); Supplier Footprint: 1206; JLCPCB Part Class: 扩展库; Datasheet: https://atta.szlcsc.com/upload/public/pdf/source/20211221/925EC7D7225764EE0046F22065062C87.pdf; Supplier: LCSC; Type: 厚膜电阻; Tolerance: ±5%; Power(Watts): 250mW; Overload Voltage (Max): 200V; Temperature Coefficient: ±100ppm/℃; Operating Temperature Range: -55℃~+155℃
R51 R53 R55 R57 R59 = RC0603FR-07390KL: LCSC Part Name: 厚膜电阻 390kΩ ±1% 100mW; Supplier Part: C137735; Manufacturer: YAGEO(国巨); Supplier Footprint: 0603; JLCPCB Part Class: 扩展库; Datasheet: https://atta.szlcsc.com/upload/public/pdf/source/20180821/C275644_0D56F95EFF785E7D9A1FEF436B37DA78.pdf; Supplier: LCSC; Type: 厚膜电阻; Tolerance: ±1%; Power(Watts): 100mW; Overload Voltage (Max): 75V; Temperature Coefficient: ±100ppm/℃; Operating Temperature Range: -55℃~+155℃
U10 U16 U17 = TPS54302DDCR: 功能类型:降压型;输出类型:固定;工作电压:4.5V~28V;输出电压:5V;输出电流:3A;; LCSC Part Name: 4.5V至28V输入、3A输出、EMI友好的同步降压转换器; Supplier Part: C311983; Manufacturer: TI(德州仪器); Supplier Footprint: TSOT-23-6; JLCPCB Part Class: 扩展库; Datasheet: https://www.ti.com/cn/lit/gpn/tps54302; Supplier: LCSC; Function: 降压型; Output Type: 固定; Input Voltage: 4.5V~28V; Output Voltage: 5V; Output Current: 3A; Switching Frequency: 400kHz; Operating Temperature: -40℃~+125℃; Synchronous Rectification: 是; Number of Outputs: 1; Topology: 降压式; Quiescent Current (Iq): 45uA; Switch tube (built-in/external): 内置
U24 = RS601-1020011BB: Supplier Part: C2885784; Manufacturer: HCTL(华灿天禄); Supplier Footprint: 插件; JLCPCB Part Class: 扩展库; Datasheet: https://atta.szlcsc.com/upload/public/pdf/source/20210820/EDA204CBF6D3843A462B7BF46F14BDE3.pdf; Supplier: LCSC; Switch Length: 21mm; Switch Width: 15mm; Switch Height: 13.6mm; Actuator Type: 凹面弯曲; With Lamp: 无; Pin Style: 焊片; Actuator Color: 黑色; Contact Current: 8A; Voltage Rating (AC): 250V; Circuit: 单刀双掷; Mechanical Life: 1万次; Operating Temperature: -25℃~+85℃; Actuator Identifier: - O
U27-U31 = MT3608: LCSC Part Name: 高效1.2MHz 2A升压转换器; Supplier Part: C84817; Manufacturer: 西安航天民芯; Supplier Footprint: SOT-23-6; JLCPCB Part Class: 扩展库; Datasheet: https://atta.szlcsc.com/upload/public/pdf/source/20161110/1478743351706.pdf; Supplier: LCSC; Function: 升压型; Output Type: 可调; Input Voltage: 2V~24V; Output Voltage: 28V; Output Current: 2A; Switching Frequency: 1.2MHz; Operating Temperature: -40℃~+85℃; Synchronous Rectification: 否; Number of Outputs: 1; Topology: 升压式; Quiescent Current (Iq): 200uA; Switch tube (built-in/external): 内置
P1 = WJ500V-5.08-3P: LCSC Part Name: 5.08mm 1x3P 排数:1 每排P数:3 直插; Supplier Part: C72334; Manufacturer: KANGNEX(康奈克斯电气); Supplier Footprint: 插件,P=5.08mm; JLCPCB Part Class: 扩展库; Datasheet: https://atta.szlcsc.com/upload/public/pdf/source/20191225/C72334_8A5EF831D67650233B6B1E3F2BC06274.pdf; Supplier: LCSC; Structure: 1x3P; Pitch: 5.08mm; Color: 绿色; Mounting Style: 直插; Current Rating (Max): 18A; Voltage Rating (Max): 250V; Number of Pins: 3P; Number of Rows: 1; Wire Gauge - AWG: 14~30; Wire Gauge - mm2: 2.5; Number of PINs Per Row: 3; Operating Temperature Range: -40℃~+105℃
Q1 = SS8050_C7420370: LCSC Part Name: H档 200-350; Supplier Part: C7420370; Manufacturer: 宏嘉诚; Supplier Footprint: SOT-23; JLCPCB Part Class: 扩展库; Datasheet: https://atta.szlcsc.com/upload/public/pdf/source/20250205/5DB94E86981B5B1A1866D18E379C0D4F.pdf; Supplier: LCSC; type: NPN; Current - Collector(Ic): 1.5A; Collector - Emitter Voltage VCEO: 25V; Pd - Power Dissipation: 300mW; DC Current Gain: 120@100mA,1.0V; Transition frequency(fT): 100MHz; Current - Collector Cutoff: 100nA; Vce Saturation(VCE(sat)): 500mV; Operating Temperature: -55℃~+150℃
U25 = W25Q16JVSNIQ_C2456211: Supplier Part: C2456211; Manufacturer: WINBOND(华邦); Supplier Footprint: SOIC-8; JLCPCB Part Class: 扩展库; Datasheet: https://atta.szlcsc.com/upload/public/pdf/source/20190529/C115407_78E5B4F96E7138D299EC51EC5982A1A5.pdf; Supplier: LCSC
U26 = ZX-PM2.54-1-2PY: LCSC Part Name: 1x2P 间距:2.54mm 直插; Supplier Part: C7499322; Manufacturer: Megastar(兆星); Supplier Footprint: 插件,P=2.54mm; JLCPCB Part Class: 扩展库; Datasheet: https://atta.szlcsc.com/upload/public/pdf/source/20231122/F22175ABE3DCBFEB9E36A2E7DA44623C.pdf; Supplier: LCSC; Holes Structure: 1x2P; Pitch: 2.54mm; Circular Hole / Square Hole: 方孔; Mounting Type: 直插; Number of Rows: 单排; Number of Holes: 2P; Voltage Rating (Max): 1kV; Holes Direction: 顶部; Insulation Height: 8.5mm; Contact Plating: 金; Operating Temperature Range: -40℃~+105℃; Soldering Temperature(Max): 260℃@5S

## Nets
3V: B1.2 C106.1 R48.1 U24.1
3V3: C10.2 C11.2 C12.2 C13.2 C14.2 C15.2 C17.2 C18.2 C19.1 C27.1 C29.1 C31.1 C33.1 C79.2 C80.2 C81.2 C91.1 C93.1 C95.1 C103.2 C105.2 H1.2 L7.1 R2.1 R4.2 R31.2 R44.2 U1.6(VBAT) U1.11(VDD) U1.19(VDD) U1.28(VDD) U1.50(VDD) U1.75(VDD) U1.100(VDD) U6.1(VCCA) U7.1(VCCA) U8.1(VCCA) U9.1(VCCA) U19.1(VCCA) U19.8(OE) U20.1(VCCA) U20.8(OE) U21.1(VCCA) U21.8(OE) U22.1(VCCA) U22.8(OE) U25.3(WP#/IO2) U25.7(HOLD#/RESET#/IO3) U25.8(VCC)
5V: C20.1 C28.1 C30.1 C32.1 C34.1 C85.2 C86.2 C87.2 C92.1 C94.1 C96.1 L8.1 P1.2 R34.2 U6.6(VCCB) U7.6(VCCB) U8.6(VCCB) U9.6(VCCB) U19.14(VCCB) U20.14(VCCB) U21.14(VCCB) U22.14(VCCB)
GND: B1.1 C1.1 C2.1 C3.1 C4.1 C5.1 C6.1 C7.1 C8.2 C10.1 C11.1 C12.1 C13.1 C14.1 C15.1 C17.1 C18.1 C19.2 C20.2 C27.2 C28.2 C29.2 C30.2 C31.2 C32.2 C33.2 C34.2 C36.1 C37.1 C38.1 C39.1 C77.1 C78.1 C79.1 C80.1 C83.1 C84.1 C85.1 C86.1 C88.2 C89.1 C91.2 C92.2 C93.2 C94.2 C95.2 C96.2 C98.1 C100.1 C101.1 C102.2 C103.1 C104.1 C105.1 C106.2 C107.1 C108.1 C110.2 C112.1 C114.2 C116.1 C118.2 C120.1 C122.2 C124.1 C126.2 C128.1 C129.1 C130.1 C131.1 C132.1 C133.1 C134.1 C135.1 C136.1 C137.1 CN1.1(-) CN2.1 CN3.1 CN4.1 CN5.1 H1.3 LED1.2(-) LED2.1(K) P1.1 Q1.2(E) Q2.3(S) R1.1 R5.1 R6.1 R9.2 R30.1 R33.2 R36.2 R37.1 R38.2 R41.1 R42.1 R48.2 R52.1 R54.1 R56.1 R58.1 R60.1 SW1.1 U1.10(VSS) U1.20(VSSA) U1.27(VSS) U1.74(VSS) U1.99(VSS) U6.2(GND) U6.5(DIR) U7.2(GND) U7.5(DIR) U8.2(GND) U8.5(DIR) U9.2(GND) U9.5(DIR) U10.1(GND) U16.1(GND) U17.1(GND) U18.1(GND) U18.9(PAD) U19.7(GND) U20.7(GND) U21.7(GND) U22.7(GND) U23.14(GND) U23.28(GND) U23.29(EP) U24.3 U25.4(GND) U27.2(GND) U28.2(GND) U29.2(GND) U30.2(GND) U31.2(GND)
VDDA: C8.1 C104.2 R2.2 R3.2 U1.22(VDDA)
BLDC1_24V: C110.1 C128.2 CN2.2 D1.2(K) R51.2
BLDC1_BRA: CN2.6 U19.13(B1)
BLDC1_BRA_3V3: U1.60(PD13) U19.2(A1)
BLDC1_FG: CN2.3 U6.4(B)
BLDC1_FG_3V3: U1.59(PD12) U6.3(A)
BLDC1_PWM: CN2.4 U19.10(B4)
BLDC1_PWM_3V3: U1.62(PD15) U19.5(A4)
BLDC1_REV: CN2.5 U19.12(B2)
BLDC1_REV_3V3: U1.61(PD14) U19.3(A2)
BLDC2_24V: C114.1 C130.2 CN3.2 D2.2(K) R53.2
BLDC2_BRA: CN3.6 U20.13(B1)
BLDC2_BRA_3V3: U1.33(PC4) U20.2(A1)
BLDC2_FG: CN3.3 U7.4(B)
BLDC2_FG_3V3: U1.31(PA6) U7.3(A)
BLDC2_PWM: CN3.4 U20.10(B4)
BLDC2_PWM_3V3: U1.36(PB1) U20.5(A4)
BLDC2_REV: CN3.5 U20.12(B2)
BLDC2_REV_3V3: U1.34(PC5) U20.3(A2)
BLDC3_24V: C118.1 C132.2 CN4.2 D3.2(K) R55.2
BLDC3_BRA: CN4.6 U21.13(B1)
BLDC3_BRA_3V3: U1.25(PA2) U21.2(A1)
BLDC3_FG: CN4.3 U8.4(B)
BLDC3_FG_3V3: U1.24(PA1) U8.3(A)
BLDC3_PWM: CN4.4 U21.10(B4)
BLDC3_PWM_3V3: U1.26(PA3) U21.5(A4)
BLDC3_REV: CN4.5 U21.12(B2)
BLDC3_REV_3V3: U1.29(PA4) U21.3(A2)
BLDC4_24V: C122.1 C135.2 CN5.2 D4.2(K) R57.2
BLDC4_BRA: CN5.6 U22.13(B1)
BLDC4_BRA_3V3: U1.42(PE11) U22.2(A1)
BLDC4_FG: CN5.3 U9.4(B)
BLDC4_FG_3V3: U1.40(PE9) U9.3(A)
BLDC4_PWM: CN5.4 U22.10(B4)
BLDC4_PWM_3V3: U1.45(PE14) U22.5(A4)
BLDC4_REV: CN5.5 U22.12(B2)
BLDC4_REV_3V3: U1.43(PE12) U22.3(A2)
BOOT0: H1.1 R1.2 U1.94(BOOT0)
MC7RE_SBUS: P1.3 R45.2
ORI_24V: C36.2 C37.2 C77.2 C78.2 C83.2 C84.2 C107.2 C108.2 C112.2 C116.2 C120.2 C124.2 C129.2 C131.2 C133.2 C134.2 C137.2 L9.2 L10.2 L11.2 L12.2 L13.2 Q2.2(D) R8.1 R32.1 R35.1 R49.1 R50.2 U10.3(VIN) U16.3(VIN) U17.3(VIN) U27.4(EN) U27.5(IN) U28.4(EN) U28.5(IN) U29.4(EN) U29.5(IN) U30.4(EN) U30.5(IN) U31.4(EN) U31.5(IN)
ORI_24V_IN: CN1.2(+) R49.2
PUMP_12V: C38.2 C39.2 C40.2 C88.1 C89.2 L1.1 R7.2 U18.5(VM)
PUMP_IN1: U1.96(PB9) U18.3(IN1)
PUMP_IN2: U1.95(PB8) U18.2(IN2)
PUMP_OUT1: C90.1 DC1.1 U18.6(OUT1)
PUMP_OUT2: C90.2 DC1.2 U18.8(OUT2)
PUMP_VREF: U1.97(PE0) U18.4(VREF)
REMOTE_DATA: Q1.3(C) R44.1 U1.87(PD6)
SPI3_CS: U1.77(PA15) U25.1(CS#)
SPI3_MISO: U1.79(PC11) U25.2(DO/IO1)
SPI3_MOSI: U1.80(PC12) U25.5(DI/IO0)
SPI3_SCK: U1.78(PC10) U25.6(CLK)
STEPPER_24V: C99.1 C100.2 C101.2 C102.1 C126.1 C136.2 D5.2(K) R43.1 R59.2 U23.4(VMA) U23.11(VMB)
STEPPER_AOUT1: CN6.1 U23.5(AOUT1)
STEPPER_AOUT2: CN6.2 U23.7(AOUT2)
STEPPER_BOUT1: CN6.4 U23.10(BOUT1)
STEPPER_BOUT2: CN6.3 U23.8(BOUT2)
STEPPER_DECAY: U1.57(PD10) U23.19(DECAY)
STEPPER_DIR: U1.56(PD9) U23.20(DIR)
STEPPER_MODE0: U1.53(PB14) U23.24(MODE0)
STEPPER_MODE1: U1.52(PB13) U23.25(MODE1)
STEPPER_MODE2: U1.51(PB12) U23.26(MODE2)
STEPPER_NEABL: U1.55(PD8) U23.21(NENBL)
STEPPER_NFLT: R40.1 U1.64(PC7) U23.18(nFAULT)
STEPPER_NHOME: R39.1 U1.58(PD11) U23.27(nHOME)
STEPPER_NRST: U1.65(PC8) U23.16(nRESET)
STEPPER_NSLP: U1.63(PC6) U23.17(nSLEEP)
STEPPER_STEP: U1.54(PB15) U23.22(STEP)
STEPPER_V3P3OUT: C98.2 R39.2 R40.2 U23.12(AVREF) U23.13(BVREF) U23.15(V3P3OUT)
SWCLK: H1.5 U1.76(PA14)
SWDIO: H1.4 U1.72(PA13)
U10_FB: C40.1 R6.2 R7.1 U10.4(FB)
U16_FB: C81.1 R30.2 R31.1 U16.4(FB)
U17_FB: C87.1 R34.1 R37.2 U17.4(FB)
USART1_RX: U1.69(PA10) U26.2
USART1_TX: U1.68(PA9) U26.1
$1N1521: C1.2 SW1.2 U1.14(NRST)
$1N1741: C2.2 U1.49(VCAP_1)
$1N1747: C3.2 U1.73(VCAP_2)
$1N1870: C4.2 U1.13(PH1) X1.2(OSC2)
$1N1876: C5.2 U1.12(PH0) X1.1(OSC1)
$1N2151: C6.2 U1.8(PC14) X2.2
$1N2157: C7.2 U1.9(PC15) X2.1
$1N3732: R3.1 U1.21(VREF+)
$1N4233: LED1.1(+) R4.1
$1N4726: R5.2 U1.37(PB2)
$2N546: C35.1 L1.2 U10.2(SW)
$2N547: C35.2 U10.6(BOOT)
$2N554: R8.2 R9.1 U10.5(EN)
$2N8124: C76.1 L7.2 U16.2(SW)
$2N8125: C76.2 U16.6(BOOT)
$2N8132: R32.2 R33.1 U16.5(EN)
$2N11800: C82.1 L8.2 U17.2(SW)
$2N11801: C82.2 U17.6(BOOT)
$2N11808: R35.2 R36.1 U17.5(EN)
$2N21564: Q2.1(G) U24.2
$2N35277: LED2.2(A) R50.1
$2N38656: R51.1 R52.2 U27.3(FB)
$2N38817: D1.1(A) L9.1 U27.1(SW)
$2N39541: R53.1 R54.2 U28.3(FB)
$2N39555: D2.1(A) L10.1 U28.1(SW)
$2N39932: R55.1 R56.2 U29.3(FB)
$2N39946: D3.1(A) L11.1 U29.1(SW)
$2N40323: R57.1 R58.2 U30.3(FB)
$2N40337: D4.1(A) L12.1 U30.1(SW)
$2N40714: R59.1 R60.2 U31.3(FB)
$2N40728: D5.1(A) L13.1 U31.1(SW)
$3N2135: R38.1 U18.7(ISEN)
$3N5415: C97.1 U23.2(CP2)
$3N5416: C97.2 U23.1(CP1)
$3N5419: R41.2 U23.6(ISENA)
$3N5420: R42.2 U23.9(ISENB)
$3N5442: C99.2 R43.2 U23.3(VCP)
$6N327: Q1.1(B) R45.1

Not connected (* = marked no-connect by the designer): CN1 3* 4*; DC1 3*; U1 1(PE2) 2(PE3) 3(PE4) 4(PE5) 5(PE6) 7(PC13) 15(PC0) 16(PC1) 17(PC2) 18(PC3) 23(PA0) 30(PA5) 32(PA7) 35(PB0) 38(PE7) 39(PE8) 41(PE10) 44(PE13) 46(PE15) 47(PB10) 48(PB11) 66(PC9) 67(PA8) 70(PA11) 71(PA12) 81(PD0) 82(PD1) 83(PD2) 84(PD3) 85(PD4) 86(PD5) 88(PD7) 89(PB3) 90(PB4) 91(PB5) 92(PB6) 93(PB7) 98(PE1); U19 4(A3)* 6(NC)* 9(NC)* 11(B3)*; U20 4(A3)* 6(NC)* 9(NC)* 11(B3)*; U21 4(A3)* 6(NC)* 9(NC)* 11(B3)*; U22 4(A3)* 6(NC)* 9(NC)* 11(B3)*; U23 23(NC)*; U27 6(NC)*; U28 6(NC)*; U29 6(NC)*; U30 6(NC)*; U31 6(NC)*

## Notes on the sheets
sheet 1
- MasterDriver
- Master indicated LED
- SWD download
sheet 2
- 24to12V_BuckConverter
- 24V_Stabilivolt
- 24to3.3V_BuckConverter
- 24to5V_BuckConverter
- Original 24V input port
- 2
- 1
- 3
sheet 3
- Level conversion of brushless motor control signal
- Brushed DC driver
- Stepper driver
sheet 4
- Remote SBUS
- External Flash
